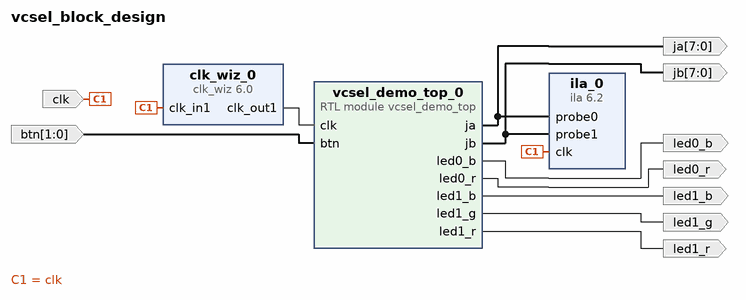
[diagram p0: block diagram of the top level]
# Vivado block design vcsel_block_design, xc7z020clg484-1, Vivado 2024.2
create_bd_design vcsel_block_design

create_bd_port -dir I -from 1 -to 0 btn
create_bd_port -dir O led0_b
create_bd_port -dir O led0_r
create_bd_port -dir O led1_b
create_bd_port -dir O led1_r
create_bd_port -dir O led1_g
create_bd_port -dir O -from 7 -to 0 ja
create_bd_port -dir O -from 7 -to 0 jb
create_bd_port -dir I -type clk clk
set_property -dict {CONFIG.ASSOCIATED_RESET reset} [get_bd_ports clk]

create_bd_cell -type module -reference vcsel_demo_top vcsel_demo_top_0
create_bd_cell -type ip -vlnv xilinx.com:ip:clk_wiz:6.0 clk_wiz_0
set_property -dict {CONFIG.RESET_PORT reset CONFIG.RESET_TYPE ACTIVE_HIGH} [get_bd_cells clk_wiz_0]
create_bd_cell -type ip -vlnv xilinx.com:ip:ila:6.2 ila_0
set_property -dict [list \
  CONFIG.C_MONITOR_TYPE Native \
  CONFIG.C_NUM_OF_PROBES 2 \
  CONFIG.C_PROBE0_WIDTH 8 \
  CONFIG.C_PROBE1_WIDTH 8 \
] [get_bd_cells ila_0]

# ---- connections ----

connect_bd_net -net btn_0_1 [get_bd_ports btn] [get_bd_pins vcsel_demo_top_0/btn]
connect_bd_net -net clk_in1_0_1 [get_bd_ports clk] [get_bd_pins clk_wiz_0/clk_in1] [get_bd_pins ila_0/clk]
connect_bd_net [get_bd_pins clk_wiz_0/clk_out1] [get_bd_pins vcsel_demo_top_0/clk]
connect_bd_net [get_bd_pins vcsel_demo_top_0/ja] [get_bd_ports ja] [get_bd_pins ila_0/probe0]
connect_bd_net [get_bd_pins vcsel_demo_top_0/jb] [get_bd_ports jb] [get_bd_pins ila_0/probe1]
connect_bd_net [get_bd_pins vcsel_demo_top_0/led0_b] [get_bd_ports led0_b]
connect_bd_net [get_bd_pins vcsel_demo_top_0/led0_r] [get_bd_ports led0_r]
connect_bd_net [get_bd_pins vcsel_demo_top_0/led1_b] [get_bd_ports led1_b]
connect_bd_net [get_bd_pins vcsel_demo_top_0/led1_g] [get_bd_ports led1_g]
connect_bd_net [get_bd_pins vcsel_demo_top_0/led1_r] [get_bd_ports led1_r]

validate_bd_design
save_bd_design
